# Altium schematic sheet I2C_MULTIPLEX.SchDoc: My title
size A3; Organization: University of California; Address1: 475 Portola Plaza; Address2: Los Angeles, CA 90095; DocumentNumber: 34; Revision: R01; SheetNumber: 34; SheetTotal: 35
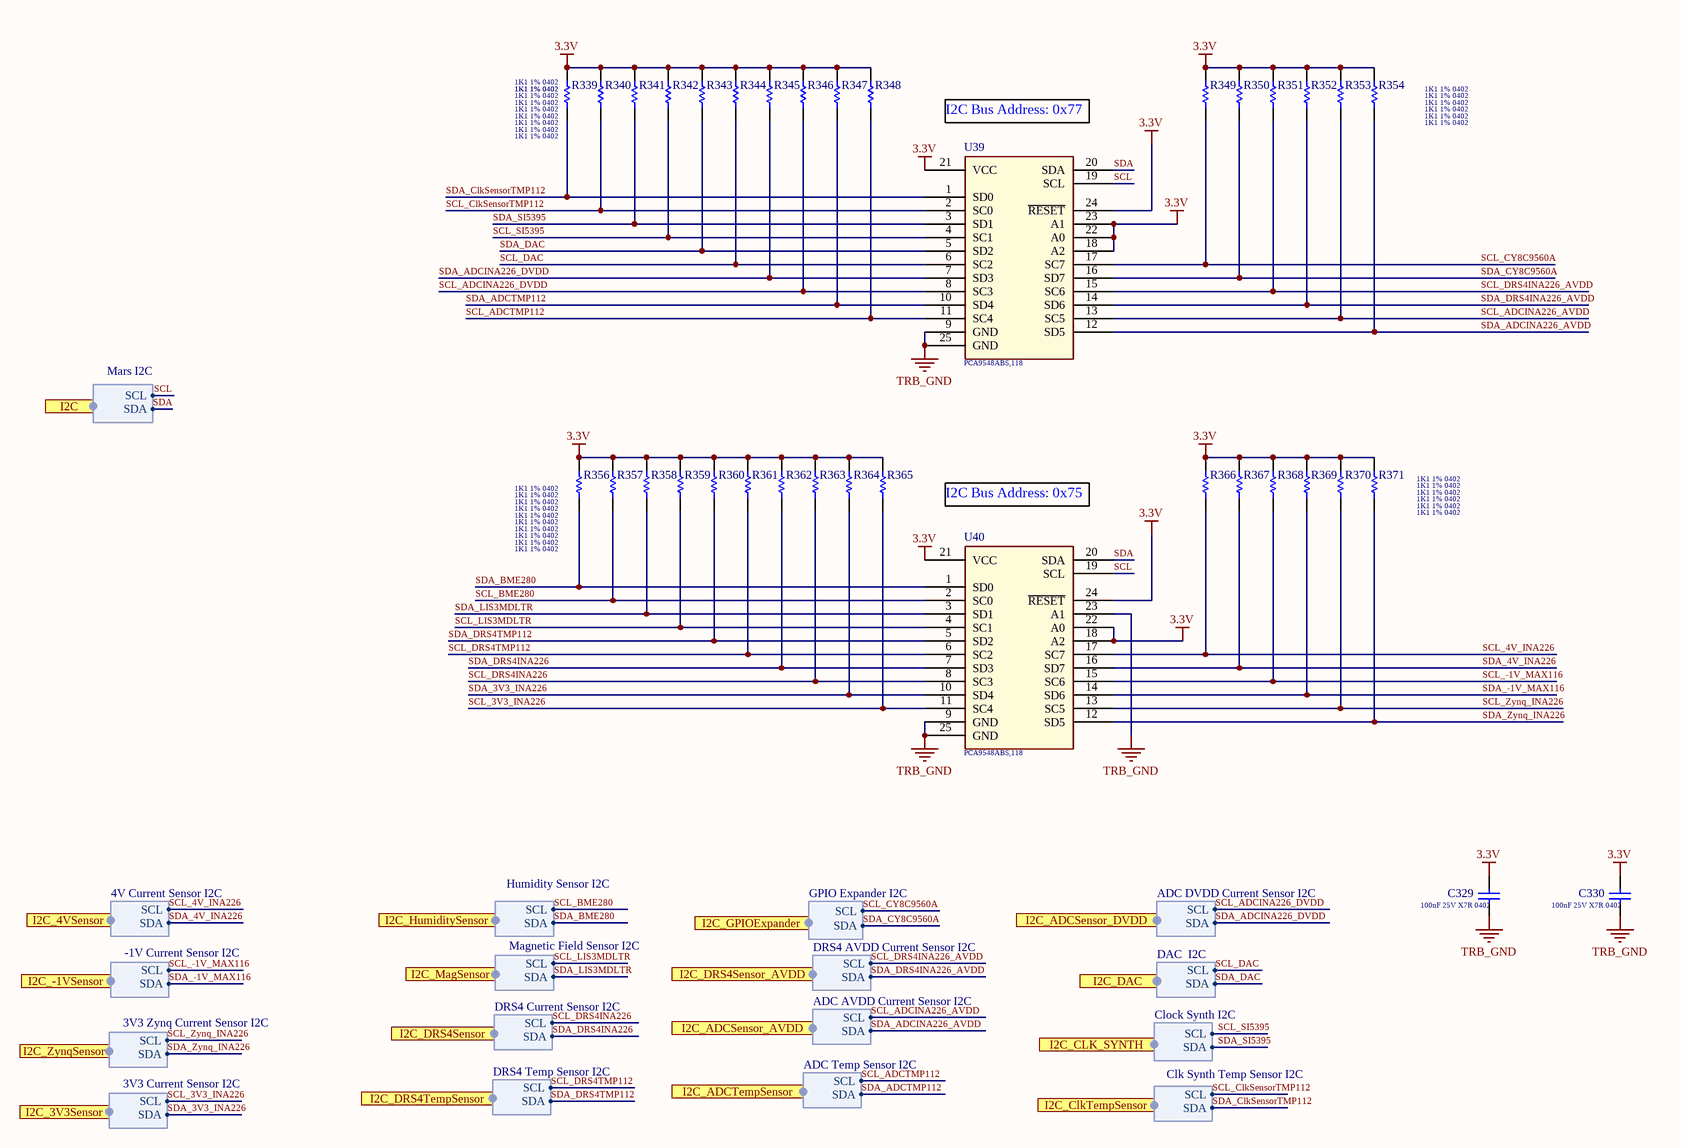
[diagram p0: I2C_MULTIPLEX.SchDoc]

## Parts
C329  Capacitance: 100nF 25V X7R 0402  [Cap_Taiyo_Yuden_TMK105B7104KV-FR_100nF]  (hidden comment: Cap_Taiyo_Yuden_TMK105B7104KV-FR_100nF)
C330  Capacitance: 100nF 25V X7R 0402  [Cap_Taiyo_Yuden_TMK105B7104KV-FR_100nF]  (hidden comment: Cap_Taiyo_Yuden_TMK105B7104KV-FR_100nF)
R339  1K1 1% 0402  [RESC0402(1005)_L]
R340  1K1 1% 0402  [RESC0402(1005)_L]
R341  1K1 1% 0402  [RESC0402(1005)_L]
R342  1K1 1% 0402  [RESC0402(1005)_L]
R343  1K1 1% 0402  [RESC0402(1005)_L]
R344  1K1 1% 0402  [RESC0402(1005)_L]
R345  1K1 1% 0402  [RESC0402(1005)_L]
R346  1K1 1% 0402  [RESC0402(1005)_L]
R347  1K1 1% 0402  [RESC0402(1005)_L]
R348  1K1 1% 0402  [RESC0402(1005)_L]
R349  1K1 1% 0402  [RESC0402(1005)_L]
R350  1K1 1% 0402  [RESC0402(1005)_L]
R351  1K1 1% 0402  [RESC0402(1005)_L]
R352  1K1 1% 0402  [RESC0402(1005)_L]
R353  1K1 1% 0402  [RESC0402(1005)_L]
R354  1K1 1% 0402  [RESC0402(1005)_L]
R356  1K1 1% 0402  [RESC0402(1005)_L]
R357  1K1 1% 0402  [RESC0402(1005)_L]
R358  1K1 1% 0402  [RESC0402(1005)_L]
R359  1K1 1% 0402  [RESC0402(1005)_L]
R360  1K1 1% 0402  [RESC0402(1005)_L]
R361  1K1 1% 0402  [RESC0402(1005)_L]
R362  1K1 1% 0402  [RESC0402(1005)_L]
R363  1K1 1% 0402  [RESC0402(1005)_L]
R364  1K1 1% 0402  [RESC0402(1005)_L]
R365  1K1 1% 0402  [RESC0402(1005)_L]
R366  1K1 1% 0402  [RESC0402(1005)_L]
R367  1K1 1% 0402  [RESC0402(1005)_L]
R368  1K1 1% 0402  [RESC0402(1005)_L]
R369  1K1 1% 0402  [RESC0402(1005)_L]
R370  1K1 1% 0402  [RESC0402(1005)_L]
R371  1K1 1% 0402  [RESC0402(1005)_L]
U39  Series: PCA9548ABS,118  [IC_NXP_PCA9548ABS,118_I2C_8Channel]  (hidden comment: IC_NXP_PCA9548ABS,118_I2C_8Channel)
U40  Series: PCA9548ABS,118  [IC_NXP_PCA9548ABS,118_I2C_8Channel]  (hidden comment: IC_NXP_PCA9548ABS,118_I2C_8Channel)

## Ports
I2C (harness Mars I2C), I2C_3V3Sensor (harness 3V3 Current Sensor I2C), I2C_4VSensor (harness 4V Current Sensor I2C), I2C_-1VSensor (harness -1V Current Sensor I2C), I2C_ADCSensor_AVDD (harness ADC AVDD Current Sensor I2C), I2C_ADCSensor_DVDD (harness ADC DVDD Current Sensor I2C), I2C_ADCTempSensor (harness ADC Temp Sensor I2C), I2C_CLK_SYNTH (harness Clock Synth I2C), I2C_ClkTempSensor (harness Clk Synth Temp Sensor I2C), I2C_DAC (harness DAC  I2C), I2C_DRS4Sensor (harness DRS4 Current Sensor I2C), I2C_DRS4Sensor_AVDD (harness DRS4 AVDD Current Sensor I2C), I2C_DRS4TempSensor (harness DRS4 Temp Sensor I2C), I2C_GPIOExpander (harness GPIO Expander I2C), I2C_HumiditySensor (harness Humidity Sensor I2C), I2C_MagSensor (harness Magnetic Field Sensor I2C), I2C_ZynqSensor (harness 3V3 Zynq Current Sensor I2C)

## Harnesses
Mars I2C: SCL, SDA
4V Current Sensor I2C: SCL, SDA
-1V Current Sensor I2C: SCL, SDA
3V3 Zynq Current Sensor I2C: SCL, SDA
3V3 Current Sensor I2C: SCL, SDA
Humidity Sensor I2C: SCL, SDA
Magnetic Field Sensor I2C: SCL, SDA
DRS4 Temp Sensor I2C: SCL, SDA
DRS4 Current Sensor I2C: SCL, SDA
DRS4 AVDD Current Sensor I2C: SCL, SDA
GPIO Expander I2C: SCL, SDA
ADC AVDD Current Sensor I2C: SCL, SDA
ADC Temp Sensor I2C: SCL, SDA
ADC DVDD Current Sensor I2C: SCL, SDA
DAC  I2C: SCL, SDA
Clock Synth I2C: SCL, SDA
Clk Synth Temp Sensor I2C: SCL, SDA

## Nets
3.3V: C329.2 C330.2 R339.2 R340.2 R341.2 R342.2 R343.2 R344.2 R345.2 R346.2 R347.2 R348.2 R349.2 R350.2 R351.2 R352.2 R353.2 R354.2 R356.2 R357.2 R358.2 R359.2 R360.2 R361.2 R362.2 R363.2 R364.2 R365.2 R366.2 R367.2 R368.2 R369.2 R370.2 R371.2 U39.18(A2) U39.21(VCC) U39.22(A0) U39.23(A1) U39.24(~{RESET}) U40.18(A2) U40.21(VCC) U40.22(A0) U40.24(~{RESET})
TRB_GND: C329.1 C330.1 U39.9(GND) U39.25(GND) U40.9(GND) U40.23(A1) U40.25(GND)
SCL: U39.19(SCL) U40.19(SCL) ; port I2C.SCL
SCL_3V3_INA226: R365.1 U40.11(SC4) ; port I2C_3V3Sensor.SCL
SCL_4V_INA226: R366.1 U40.17(SC7) ; port I2C_4VSensor.SCL
SCL_-1V_MAX116: R368.1 U40.15(SC6) ; port I2C_-1VSensor.SCL
SCL_ADCINA226_AVDD: R353.1 U39.13(SC5) ; port I2C_ADCSensor_AVDD.SCL
SCL_ADCINA226_DVDD: R346.1 U39.8(SC3) ; port I2C_ADCSensor_DVDD.SCL
SCL_ADCTMP112: R348.1 U39.11(SC4) ; port I2C_ADCTempSensor.SCL
SCL_BME280: R357.1 U40.2(SC0) ; port I2C_HumiditySensor.SCL
SCL_ClkSensorTMP112: R340.1 U39.2(SC0) ; port I2C_ClkTempSensor.SCL
SCL_CY8C9560A: R349.1 U39.17(SC7) ; port I2C_GPIOExpander.SCL
SCL_DAC: R344.1 U39.6(SC2) ; port I2C_DAC.SCL
SCL_DRS4INA226: R363.1 U40.8(SC3) ; port I2C_DRS4Sensor.SCL
SCL_DRS4INA226_AVDD: R351.1 U39.15(SC6) ; port I2C_DRS4Sensor_AVDD.SCL
SCL_DRS4TMP112: R361.1 U40.6(SC2) ; port I2C_DRS4TempSensor.SCL
SCL_LIS3MDLTR: R359.1 U40.4(SC1) ; port I2C_MagSensor.SCL
SCL_SI5395: R342.1 U39.4(SC1) ; port I2C_CLK_SYNTH.SCL
SCL_Zynq_INA226: R370.1 U40.13(SC5) ; port I2C_ZynqSensor.SCL
SDA: U39.20(SDA) U40.20(SDA) ; port I2C.SDA
SDA_3V3_INA226: R364.1 U40.10(SD4) ; port I2C_3V3Sensor.SDA
SDA_4V_INA226: R367.1 U40.16(SD7) ; port I2C_4VSensor.SDA
SDA_-1V_MAX116: R369.1 U40.14(SD6) ; port I2C_-1VSensor.SDA
SDA_ADCINA226_AVDD: R354.1 U39.12(SD5) ; port I2C_ADCSensor_AVDD.SDA
SDA_ADCINA226_DVDD: R345.1 U39.7(SD3) ; port I2C_ADCSensor_DVDD.SDA
SDA_ADCTMP112: R347.1 U39.10(SD4) ; port I2C_ADCTempSensor.SDA
SDA_BME280: R356.1 U40.1(SD0) ; port I2C_HumiditySensor.SDA
SDA_ClkSensorTMP112: R339.1 U39.1(SD0) ; port I2C_ClkTempSensor.SDA
SDA_CY8C9560A: R350.1 U39.16(SD7) ; port I2C_GPIOExpander.SDA
SDA_DAC: R343.1 U39.5(SD2) ; port I2C_DAC.SDA
SDA_DRS4INA226: R362.1 U40.7(SD3) ; port I2C_DRS4Sensor.SDA
SDA_DRS4INA226_AVDD: R352.1 U39.14(SD6) ; port I2C_DRS4Sensor_AVDD.SDA
SDA_DRS4TMP112: R360.1 U40.5(SD2) ; port I2C_DRS4TempSensor.SDA
SDA_LIS3MDLTR: R358.1 U40.3(SD1) ; port I2C_MagSensor.SDA
SDA_SI5395: R341.1 U39.3(SD1) ; port I2C_CLK_SYNTH.SDA
SDA_Zynq_INA226: R371.1 U40.12(SD5) ; port I2C_ZynqSensor.SDA

## Notes on the sheet
- I2C Bus Address: 0x77
- I2C Bus Address: 0x75
- 475 Portola Plaza
- GAPS TOF
- igarcia91@g.ucla.edu
- Los Angeles, CA
- 310-825-0344
- Size:
- Date:
- Letter
- Revision:
- Time:
- Sheet
- of
- andrew.peck@cern.ch
- spq@ucla.edu
- File:

## Library data of the parts
C329 C330 = Cap_Taiyo_Yuden_TMK105B7104KV-FR_100nF: CAP CER 100nF 25V X7R 0402; Supplier 1: Mouser; Supplier Part Number 1: 963-TMK105B7104KV-FR
R339-R354 R356-R371 = CMP-1011-00514-1: 1K1 0.063W 1% 0402 (1005 Metric)  SMD; Case-Metric: 1005; Case-EIA: 0402; Value: 1100.00 Ohm; Power: 0.063 W; Tolerance: 1 %; Technology: SMT
U39 U40 = IC_NXP_PCA9548ABS,118_I2C_8Channel: Multiplexer Switch ICs 8CH I2C SWTCH W/REST; Supplier Part Number 1: 771-PCA9548ABS118; Supplier 1: Mouser